# Altium schematic sheet Power.SchDoc
size A
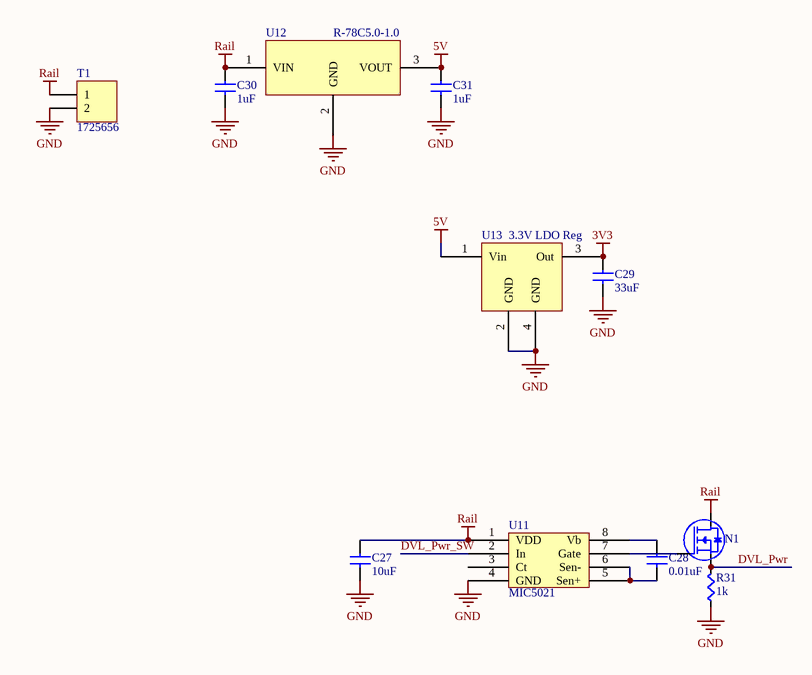
[diagram p0: Power.SchDoc]

## Parts
C27  value 10uF  [CAPC0805]  (hidden comment: Cap)
C28  value 0.01uF  [CAPC0805]  (hidden comment: Cap)
C29  value 33uF  [CAPC1206]  (hidden comment: Cap)
C30  value 1uF  [CAPC0603]  (hidden comment: Cap)
C31  value 1uF  [CAPC0603]  (hidden comment: Cap)
N1  NMOSFET_TO-220  [TO-220AB Heatsink]  (value not drawn)
R31  value 1k  [RES0603]  (hidden comment: Res)
T1  1725656  [1725656]
U11  MIC5021  [MIC5021]
U12  R-78C5.0-1.0  [R-78C5.0-1.0]
U13  3.3V LDO Reg  [SOT23-4n]

## Nets
3V3: C29.1(A) U13.3(Out)
5V: C31.1(A) U12.3(VOUT) U13.1(Vin)
GND: C27.2(B) C29.2(B) C30.2(B) C31.2(B) R31.2(B) T1.2 U11.4(GND) U12.2(GND) U13.2(GND) U13.4(GND)
Rail: C27.1(A) C30.1(A) N1.D T1.1 U11.1(VDD) U12.1(VIN)
DVL_Pwr: N1.S R31.1(A)
DVL_Pwr_SW: U11.2(In)
NetC28_1: C28.1(A) U11.8(Vb)
NetC28_2: C28.2(B) U11.5(Sen+) U11.6(Sen-)
NetN1_G: N1.G U11.7(Gate)

Not connected (* = marked no-connect by the designer): U11 3(Ct)

## Library data of the parts
N1 = NMOSFET_TO-220: NMOSFET_TO-220-Template; Supplier 1: Digi-Key; Supplier Part Number 1: IRLB3813PBF-ND
T1 = 1725656: CONN TERM BLOCK 2.54MM 2POS; Supplier 1: Digi-Key; Supplier Part Number 1: 277-1273-ND
U11 = MIC5021: IC DRIVER MOSFET HISIDE HS 8SOIC; Supplier 1: Digi-Key; Supplier Part Number 1: 576-1239-1-ND
U12 = R-78C5.0-1.0: CONV DC/DC 1A 5V OUT SIP VERT; Supplier 1: Digi-Key; Supplier Part Number 1: 945-1395-5-ND
U13 = LM3940IMPX-3.3: IC REG LDO 3.3V 1A SOT223; Supplier 1: Digi-Key; Supplier Part Number 1: LM3940IMPX-3.3/NOPBCT-ND
C27-C31 = Cap: Supplier 1: Digi-Key
  C27: Supplier Part Number 1: 445-14417-1-ND
  C28: Supplier Part Number 1: 490-1664-1-ND
  C29: Supplier Part Number 1: 445-4060-1-ND
  C30: Supplier Part Number 1: 587-2400-1-ND
  C31: Supplier Part Number 1: 1276-1946-1-ND
R31 = Res: Supplier 1: Digi-Key; Supplier Part Number 1: P1.0KGCT-ND